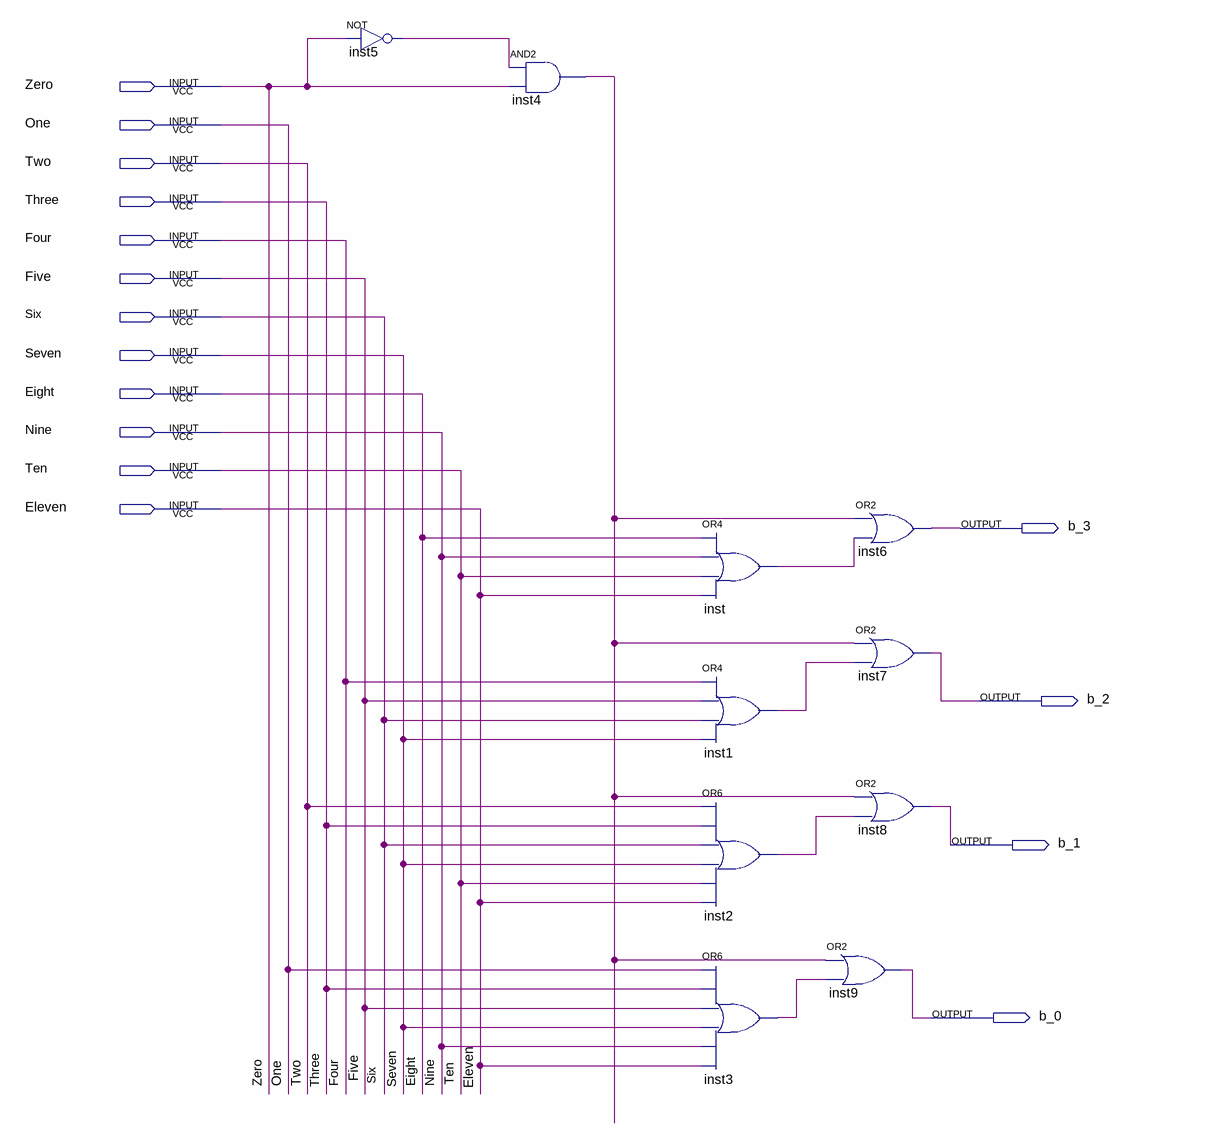
[diagram p0: schematic sheet]
// Quartus schematic work2_3.bdf as structural Verilog: 10 symbols, 16 pins
module work2_3 (
  input  Zero,
  input  One,
  input  Two,
  input  Three,
  input  Four,
  input  Five,
  input  Six,
  input  Seven,
  input  Eight,
  input  Nine,
  input  Ten,
  input  Eleven,
  output b_3,
  output b_2,
  output b_1,
  output b_0
);

  wire inst1_out, inst2_out, inst3_out, inst4_out, inst5_out, inst_out;

  not inst5 (inst5_out, Zero);
  and inst4 (inst4_out, inst5_out, Zero);
  or inst (inst_out, Eight, Nine, Ten, Eleven);
  or inst1 (inst1_out, Four, Five, Six, Seven);
  or inst2 (inst2_out, Two, Three, Six, Seven, Ten, Eleven);
  or inst3 (inst3_out, One, Three, Five, Seven, Nine, Eleven);
  or inst6 (b_3, inst4_out, inst_out);
  or inst7 (b_2, inst4_out, inst1_out);
  or inst8 (b_1, inst4_out, inst2_out);
  or inst9 (b_0, inst4_out, inst3_out);
endmodule
